# Altium project diplomka_hiearchical.PrjPcb (part 4 of 4)
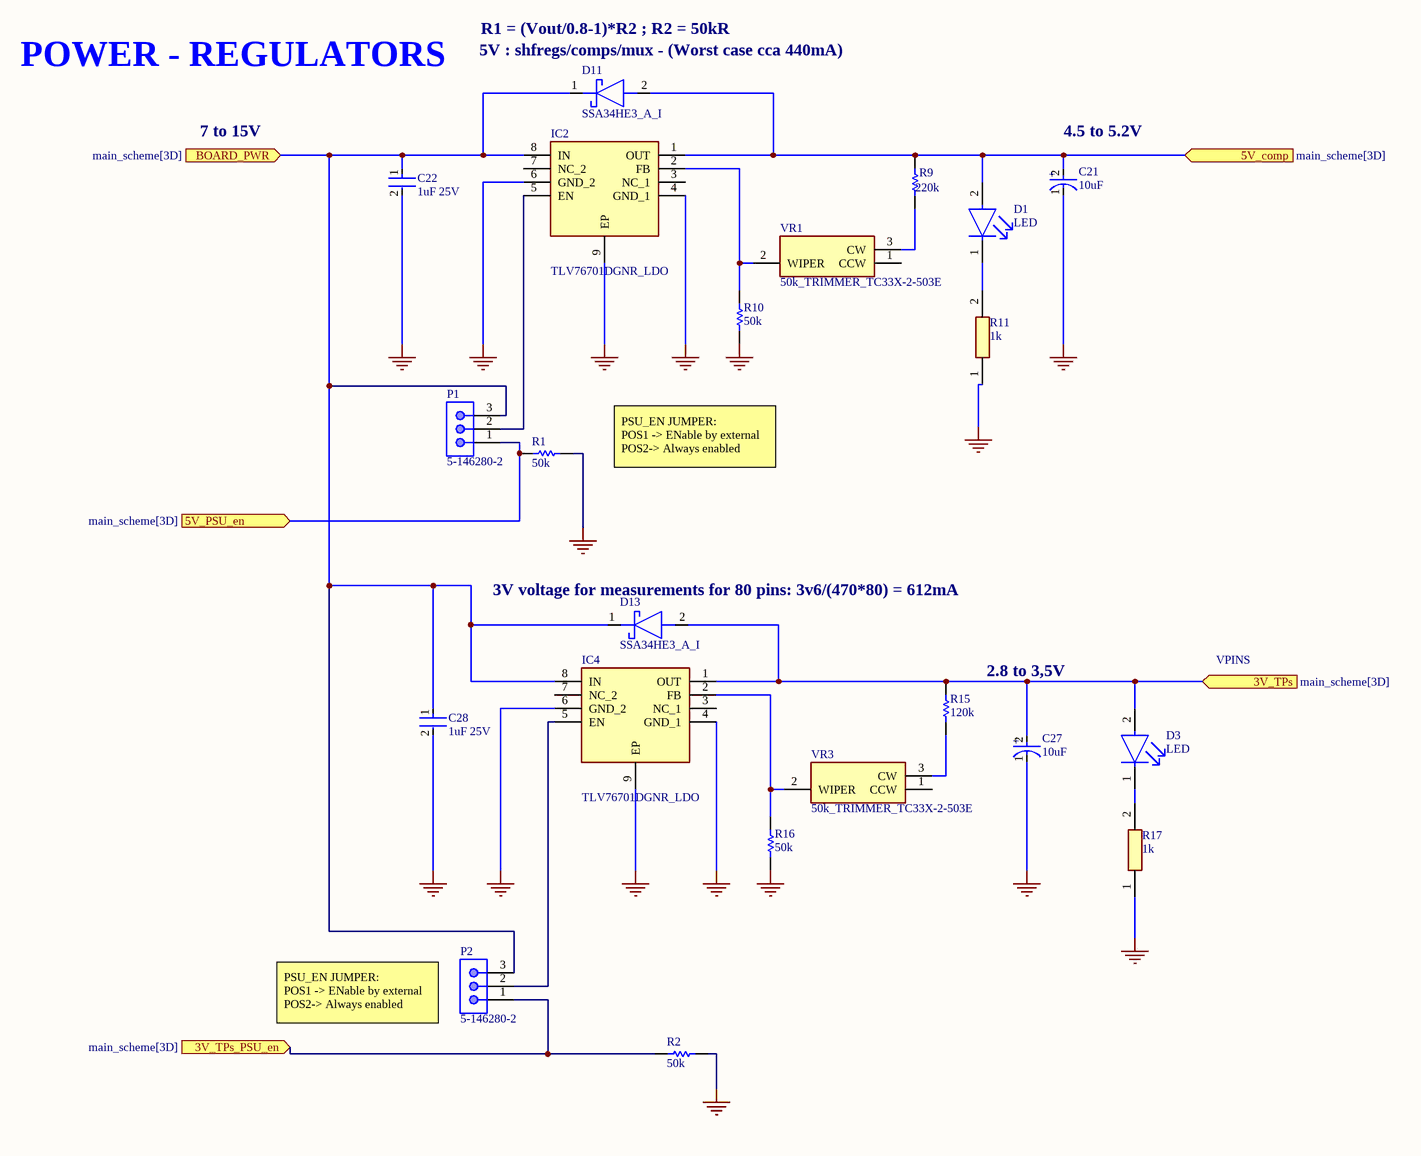
[diagram p6: POWER.SchDoc]

## Nets that join several sheets (continued)
Net8pins10_U3_5: U_ALL_channels/8pins10 (8pins10_U3.5), U_ALL_channels/8pins10/dTP (U_ALL_channels_8pins10_dTP_IC1#2.7 U_ALL_channels_8pins10_dTP_R6#2.2)
Net8pins10_U3_12: U_ALL_channels/8pins10 (8pins10_U3.12), U_ALL_channels/8pins10/dTP (U_ALL_channels_8pins10_dTP_IC1#3.7 U_ALL_channels_8pins10_dTP_R6#3.2)
Net8pins10_U3_13: U_ALL_channels/8pins10 (8pins10_U3.13), U_ALL_channels/8pins10/dTP (U_ALL_channels_8pins10_dTP_IC1#4.1 U_ALL_channels_8pins10_dTP_R5#4.2)
Net8pins10_U3_14: U_ALL_channels/8pins10 (8pins10_U3.14), U_ALL_channels/8pins10/dTP (U_ALL_channels_8pins10_dTP_IC1#4.7 U_ALL_channels_8pins10_dTP_R6#4.2)
Net8pins10_U3_15: U_ALL_channels/8pins10 (8pins10_U3.15), U_ALL_channels/8pins10/dTP (U_ALL_channels_8pins10_dTP_IC1#3.1 U_ALL_channels_8pins10_dTP_R5#3.2)
Net8pins10_U4_1: U_ALL_channels/8pins10 (8pins10_U4.1), U_ALL_channels/8pins10/dTP (U_ALL_channels_8pins10_dTP_Q1#4.1)
Net8pins10_U4_2: U_ALL_channels/8pins10 (8pins10_U4.2), U_ALL_channels/8pins10/dTP (U_ALL_channels_8pins10_dTP_Q2#3.1)
Net8pins10_U4_3: U_ALL_channels/8pins10 (8pins10_U4.3), U_ALL_channels/8pins10/dTP (U_ALL_channels_8pins10_dTP_Q1#3.1)
Net8pins10_U4_4: U_ALL_channels/8pins10 (8pins10_U4.4), U_ALL_channels/8pins10/dTP (U_ALL_channels_8pins10_dTP_Q2#2.1)
Net8pins10_U4_5: U_ALL_channels/8pins10 (8pins10_U4.5), U_ALL_channels/8pins10/dTP (U_ALL_channels_8pins10_dTP_Q1#2.1)
Net8pins10_U4_6: U_ALL_channels/8pins10 (8pins10_U4.6), U_ALL_channels/8pins10/dTP (U_ALL_channels_8pins10_dTP_Q2#1.1)
Net8pins10_U4_7: U_ALL_channels/8pins10 (8pins10_U4.7), U_ALL_channels/8pins10/dTP (U_ALL_channels_8pins10_dTP_Q1#1.1)
Net8pins10_U4_15: U_ALL_channels/8pins10 (8pins10_U4.15), U_ALL_channels/8pins10/dTP (U_ALL_channels_8pins10_dTP_Q2#4.1)
NMOS_SHFT_1TO5_NOE: main_scheme (J22.41), U_ALL_channels/8pins1 (8pins1_U2.13), U_ALL_channels/8pins2 (8pins2_U2.13), U_ALL_channels/8pins3 (8pins3_U2.13), U_ALL_channels/8pins4 (8pins4_U2.13), U_ALL_channels/8pins5 (8pins5_U2.13)
NMOS_SHFT_1TO5_RCLK: main_scheme (J22.45), U_ALL_channels/8pins1 (8pins1_U2.12), U_ALL_channels/8pins2 (8pins2_U2.12), U_ALL_channels/8pins3 (8pins3_U2.12), U_ALL_channels/8pins4 (8pins4_U2.12), U_ALL_channels/8pins5 (8pins5_U2.12)
NMOS_SHFT_1TO5_SER: main_scheme (J22.43), U_ALL_channels/8pins1 (8pins1_U2.14)
NMOS_SHFT_1TO5_SRCLK: main_scheme (J22.47), U_ALL_channels/8pins1 (8pins1_U2.11), U_ALL_channels/8pins2 (8pins2_U2.11), U_ALL_channels/8pins3 (8pins3_U2.11), U_ALL_channels/8pins4 (8pins4_U2.11), U_ALL_channels/8pins5 (8pins5_U2.11)
NMOS_SHFT_1TO5_SRCLR: main_scheme (J22.49), U_ALL_channels/8pins1 (8pins1_U2.10), U_ALL_channels/8pins2 (8pins2_U2.10), U_ALL_channels/8pins3 (8pins3_U2.10), U_ALL_channels/8pins4 (8pins4_U2.10), U_ALL_channels/8pins5 (8pins5_U2.10)
NMOS_SHFT_6TO10_NOE: main_scheme (J22.5), U_ALL_channels/8pins6 (8pins6_U2.13), U_ALL_channels/8pins7 (8pins7_U2.13), U_ALL_channels/8pins8 (8pins8_U2.13), U_ALL_channels/8pins9 (8pins9_U2.13), U_ALL_channels/8pins10 (8pins10_U2.13)
NMOS_SHFT_6TO10_RCLK: main_scheme (J22.7), U_ALL_channels/8pins6 (8pins6_U2.12), U_ALL_channels/8pins7 (8pins7_U2.12), U_ALL_channels/8pins8 (8pins8_U2.12), U_ALL_channels/8pins9 (8pins9_U2.12), U_ALL_channels/8pins10 (8pins10_U2.12)
NMOS_SHFT_6TO10_SER: main_scheme (J22.3), U_ALL_channels/8pins6 (8pins6_U2.14)
NMOS_SHFT_6TO10_SRCLK: main_scheme (J22.9), U_ALL_channels/8pins6 (8pins6_U2.11), U_ALL_channels/8pins7 (8pins7_U2.11), U_ALL_channels/8pins8 (8pins8_U2.11), U_ALL_channels/8pins9 (8pins9_U2.11), U_ALL_channels/8pins10 (8pins10_U2.11)
NMOS_SHFT_6TO10_SRCLR: main_scheme (J22.11), U_ALL_channels/8pins6 (8pins6_U2.10), U_ALL_channels/8pins7 (8pins7_U2.10), U_ALL_channels/8pins8 (8pins8_U2.10), U_ALL_channels/8pins9 (8pins9_U2.10), U_ALL_channels/8pins10 (8pins10_U2.10)
PMOS_SHFT_1TO5_NOE: main_scheme (J22.48), U_ALL_channels/8pins1 (8pins1_U4.13), U_ALL_channels/8pins2 (8pins2_U4.13), U_ALL_channels/8pins3 (8pins3_U4.13), U_ALL_channels/8pins4 (8pins4_U4.13), U_ALL_channels/8pins5 (8pins5_U4.13)
PMOS_SHFT_1TO5_RCLK: main_scheme (J22.46), U_ALL_channels/8pins1 (8pins1_U4.12), U_ALL_channels/8pins2 (8pins2_U4.12), U_ALL_channels/8pins3 (8pins3_U4.12), U_ALL_channels/8pins4 (8pins4_U4.12), U_ALL_channels/8pins5 (8pins5_U4.12)
PMOS_SHFT_1TO5_SER: main_scheme (J22.50), U_ALL_channels/8pins1 (8pins1_U4.14)
PMOS_SHFT_1TO5_SRCLK: main_scheme (J22.44), U_ALL_channels/8pins1 (8pins1_U4.11), U_ALL_channels/8pins2 (8pins2_U4.11), U_ALL_channels/8pins3 (8pins3_U4.11), U_ALL_channels/8pins4 (8pins4_U4.11), U_ALL_channels/8pins5 (8pins5_U4.11)
PMOS_SHFT_1TO5_SRCLR: main_scheme (J22.42), U_ALL_channels/8pins1 (8pins1_U4.10), U_ALL_channels/8pins2 (8pins2_U4.10), U_ALL_channels/8pins3 (8pins3_U4.10), U_ALL_channels/8pins4 (8pins4_U4.10), U_ALL_channels/8pins5 (8pins5_U4.10)
PMOS_SHFT_6TO10_NOE: main_scheme (J22.15), U_ALL_channels/8pins6 (8pins6_U4.13), U_ALL_channels/8pins7 (8pins7_U4.13), U_ALL_channels/8pins8 (8pins8_U4.13), U_ALL_channels/8pins9 (8pins9_U4.13), U_ALL_channels/8pins10 (8pins10_U4.13)
PMOS_SHFT_6TO10_RCLK: main_scheme (J22.17), U_ALL_channels/8pins6 (8pins6_U4.12), U_ALL_channels/8pins7 (8pins7_U4.12), U_ALL_channels/8pins8 (8pins8_U4.12), U_ALL_channels/8pins9 (8pins9_U4.12), U_ALL_channels/8pins10 (8pins10_U4.12)
PMOS_SHFT_6TO10_SER: main_scheme (J22.13), U_ALL_channels/8pins6 (8pins6_U4.14)
PMOS_SHFT_6TO10_SRCLK: main_scheme (J22.19), U_ALL_channels/8pins6 (8pins6_U4.11), U_ALL_channels/8pins7 (8pins7_U4.11), U_ALL_channels/8pins8 (8pins8_U4.11), U_ALL_channels/8pins9 (8pins9_U4.11), U_ALL_channels/8pins10 (8pins10_U4.11)
PMOS_SHFT_6TO10_SRCLR: main_scheme (J22.21), U_ALL_channels/8pins6 (8pins6_U4.10), U_ALL_channels/8pins7 (8pins7_U4.10), U_ALL_channels/8pins8 (8pins8_U4.10), U_ALL_channels/8pins9 (8pins9_U4.10), U_ALL_channels/8pins10 (8pins10_U4.10)
TP_1: main_scheme (J1.A1), U_ALL_channels/8pins1/dTP (U_ALL_channels_8pins1_dTP_IC1#4.3 U_ALL_channels_8pins1_dTP_Q2#4.3 U_ALL_channels_8pins1_dTP_R7#4.1)
TP_2: main_scheme (J1.B1), U_ALL_channels/8pins1/dTP (U_ALL_channels_8pins1_dTP_IC1#4.5 U_ALL_channels_8pins1_dTP_Q1#4.3 U_ALL_channels_8pins1_dTP_R8#4.1)
TP_3: main_scheme (J1.C1), U_ALL_channels/8pins1/dTP (U_ALL_channels_8pins1_dTP_IC1#3.3 U_ALL_channels_8pins1_dTP_Q2#3.3 U_ALL_channels_8pins1_dTP_R7#3.1)
TP_4: main_scheme (J1.A2), U_ALL_channels/8pins1/dTP (U_ALL_channels_8pins1_dTP_IC1#3.5 U_ALL_channels_8pins1_dTP_Q1#3.3 U_ALL_channels_8pins1_dTP_R8#3.1)
TP_5: main_scheme (J1.B2), U_ALL_channels/8pins1/dTP (U_ALL_channels_8pins1_dTP_IC1#2.3 U_ALL_channels_8pins1_dTP_Q2#2.3 U_ALL_channels_8pins1_dTP_R7#2.1)
TP_6: main_scheme (J1.C2), U_ALL_channels/8pins1/dTP (U_ALL_channels_8pins1_dTP_IC1#2.5 U_ALL_channels_8pins1_dTP_Q1#2.3 U_ALL_channels_8pins1_dTP_R8#2.1)
TP_7: main_scheme (J1.A3), U_ALL_channels/8pins1/dTP (U_ALL_channels_8pins1_dTP_IC1#1.3 U_ALL_channels_8pins1_dTP_Q2#1.3 U_ALL_channels_8pins1_dTP_R7#1.1)
TP_8: main_scheme (J1.B3), U_ALL_channels/8pins1/dTP (U_ALL_channels_8pins1_dTP_IC1#1.5 U_ALL_channels_8pins1_dTP_Q1#1.3 U_ALL_channels_8pins1_dTP_R8#1.1)
TP_9: main_scheme (J1.C3), U_ALL_channels/8pins2/dTP (U_ALL_channels_8pins2_dTP_IC1#4.3 U_ALL_channels_8pins2_dTP_Q2#4.3 U_ALL_channels_8pins2_dTP_R7#4.1)
TP_10: main_scheme (J1.A4), U_ALL_channels/8pins2/dTP (U_ALL_channels_8pins2_dTP_IC1#4.5 U_ALL_channels_8pins2_dTP_Q1#4.3 U_ALL_channels_8pins2_dTP_R8#4.1)
TP_11: main_scheme (J1.B4), U_ALL_channels/8pins2/dTP (U_ALL_channels_8pins2_dTP_IC1#3.3 U_ALL_channels_8pins2_dTP_Q2#3.3 U_ALL_channels_8pins2_dTP_R7#3.1)
TP_12: main_scheme (J1.C4), U_ALL_channels/8pins2/dTP (U_ALL_channels_8pins2_dTP_IC1#3.5 U_ALL_channels_8pins2_dTP_Q1#3.3 U_ALL_channels_8pins2_dTP_R8#3.1)
TP_13: main_scheme (J1.A5), U_ALL_channels/8pins2/dTP (U_ALL_channels_8pins2_dTP_IC1#2.3 U_ALL_channels_8pins2_dTP_Q2#2.3 U_ALL_channels_8pins2_dTP_R7#2.1)
TP_14: main_scheme (J1.B5), U_ALL_channels/8pins2/dTP (U_ALL_channels_8pins2_dTP_IC1#2.5 U_ALL_channels_8pins2_dTP_Q1#2.3 U_ALL_channels_8pins2_dTP_R8#2.1)
TP_15: main_scheme (J1.C5), U_ALL_channels/8pins2/dTP (U_ALL_channels_8pins2_dTP_IC1#1.3 U_ALL_channels_8pins2_dTP_Q2#1.3 U_ALL_channels_8pins2_dTP_R7#1.1)
TP_16: main_scheme (J1.A6), U_ALL_channels/8pins2/dTP (U_ALL_channels_8pins2_dTP_IC1#1.5 U_ALL_channels_8pins2_dTP_Q1#1.3 U_ALL_channels_8pins2_dTP_R8#1.1)
TP_17: main_scheme (J1.B6), U_ALL_channels/8pins3/dTP (U_ALL_channels_8pins3_dTP_IC1#4.3 U_ALL_channels_8pins3_dTP_Q2#4.3 U_ALL_channels_8pins3_dTP_R7#4.1)
TP_18: main_scheme (J1.C6), U_ALL_channels/8pins3/dTP (U_ALL_channels_8pins3_dTP_IC1#4.5 U_ALL_channels_8pins3_dTP_Q1#4.3 U_ALL_channels_8pins3_dTP_R8#4.1)
TP_19: main_scheme (J1.A7), U_ALL_channels/8pins3/dTP (U_ALL_channels_8pins3_dTP_IC1#3.3 U_ALL_channels_8pins3_dTP_Q2#3.3 U_ALL_channels_8pins3_dTP_R7#3.1)
TP_20: main_scheme (J1.B7), U_ALL_channels/8pins3/dTP (U_ALL_channels_8pins3_dTP_IC1#3.5 U_ALL_channels_8pins3_dTP_Q1#3.3 U_ALL_channels_8pins3_dTP_R8#3.1)
TP_21: main_scheme (J1.C7), U_ALL_channels/8pins3/dTP (U_ALL_channels_8pins3_dTP_IC1#2.3 U_ALL_channels_8pins3_dTP_Q2#2.3 U_ALL_channels_8pins3_dTP_R7#2.1)
TP_22: main_scheme (J1.A8), U_ALL_channels/8pins3/dTP (U_ALL_channels_8pins3_dTP_IC1#2.5 U_ALL_channels_8pins3_dTP_Q1#2.3 U_ALL_channels_8pins3_dTP_R8#2.1)
TP_23: main_scheme (J1.B8), U_ALL_channels/8pins3/dTP (U_ALL_channels_8pins3_dTP_IC1#1.3 U_ALL_channels_8pins3_dTP_Q2#1.3 U_ALL_channels_8pins3_dTP_R7#1.1)
TP_24: main_scheme (J1.C8), U_ALL_channels/8pins3/dTP (U_ALL_channels_8pins3_dTP_IC1#1.5 U_ALL_channels_8pins3_dTP_Q1#1.3 U_ALL_channels_8pins3_dTP_R8#1.1)
TP_25: main_scheme (J1.A9), U_ALL_channels/8pins4/dTP (U_ALL_channels_8pins4_dTP_IC1#4.3 U_ALL_channels_8pins4_dTP_Q2#4.3 U_ALL_channels_8pins4_dTP_R7#4.1)
TP_26: main_scheme (J1.B9), U_ALL_channels/8pins4/dTP (U_ALL_channels_8pins4_dTP_IC1#4.5 U_ALL_channels_8pins4_dTP_Q1#4.3 U_ALL_channels_8pins4_dTP_R8#4.1)
TP_27: main_scheme (J1.C9), U_ALL_channels/8pins4/dTP (U_ALL_channels_8pins4_dTP_IC1#3.3 U_ALL_channels_8pins4_dTP_Q2#3.3 U_ALL_channels_8pins4_dTP_R7#3.1)
TP_28: main_scheme (J1.A10), U_ALL_channels/8pins4/dTP (U_ALL_channels_8pins4_dTP_IC1#3.5 U_ALL_channels_8pins4_dTP_Q1#3.3 U_ALL_channels_8pins4_dTP_R8#3.1)
TP_29: main_scheme (J1.B10), U_ALL_channels/8pins4/dTP (U_ALL_channels_8pins4_dTP_IC1#2.3 U_ALL_channels_8pins4_dTP_Q2#2.3 U_ALL_channels_8pins4_dTP_R7#2.1)
TP_30: main_scheme (J1.C10), U_ALL_channels/8pins4/dTP (U_ALL_channels_8pins4_dTP_IC1#2.5 U_ALL_channels_8pins4_dTP_Q1#2.3 U_ALL_channels_8pins4_dTP_R8#2.1)
TP_31: main_scheme (J1.A11), U_ALL_channels/8pins4/dTP (U_ALL_channels_8pins4_dTP_IC1#1.3 U_ALL_channels_8pins4_dTP_Q2#1.3 U_ALL_channels_8pins4_dTP_R7#1.1)
TP_32: main_scheme (J1.B11), U_ALL_channels/8pins4/dTP (U_ALL_channels_8pins4_dTP_IC1#1.5 U_ALL_channels_8pins4_dTP_Q1#1.3 U_ALL_channels_8pins4_dTP_R8#1.1)
TP_33: main_scheme (J1.C11), U_ALL_channels/8pins5/dTP (U_ALL_channels_8pins5_dTP_IC1#4.3 U_ALL_channels_8pins5_dTP_Q2#4.3 U_ALL_channels_8pins5_dTP_R7#4.1)
TP_34: main_scheme (J1.A12), U_ALL_channels/8pins5/dTP (U_ALL_channels_8pins5_dTP_IC1#4.5 U_ALL_channels_8pins5_dTP_Q1#4.3 U_ALL_channels_8pins5_dTP_R8#4.1)
TP_35: main_scheme (J1.B12), U_ALL_channels/8pins5/dTP (U_ALL_channels_8pins5_dTP_IC1#3.3 U_ALL_channels_8pins5_dTP_Q2#3.3 U_ALL_channels_8pins5_dTP_R7#3.1)
TP_36: main_scheme (J1.C12), U_ALL_channels/8pins5/dTP (U_ALL_channels_8pins5_dTP_IC1#3.5 U_ALL_channels_8pins5_dTP_Q1#3.3 U_ALL_channels_8pins5_dTP_R8#3.1)
TP_37: main_scheme (J1.A13), U_ALL_channels/8pins5/dTP (U_ALL_channels_8pins5_dTP_IC1#2.3 U_ALL_channels_8pins5_dTP_Q2#2.3 U_ALL_channels_8pins5_dTP_R7#2.1)
TP_38: main_scheme (J1.B13), U_ALL_channels/8pins5/dTP (U_ALL_channels_8pins5_dTP_IC1#2.5 U_ALL_channels_8pins5_dTP_Q1#2.3 U_ALL_channels_8pins5_dTP_R8#2.1)
TP_39: main_scheme (J1.C13), U_ALL_channels/8pins5/dTP (U_ALL_channels_8pins5_dTP_IC1#1.3 U_ALL_channels_8pins5_dTP_Q2#1.3 U_ALL_channels_8pins5_dTP_R7#1.1)
TP_40: main_scheme (J1.A14), U_ALL_channels/8pins5/dTP (U_ALL_channels_8pins5_dTP_IC1#1.5 U_ALL_channels_8pins5_dTP_Q1#1.3 U_ALL_channels_8pins5_dTP_R8#1.1)
TP_41: main_scheme (J1.B14), U_ALL_channels/8pins6/dTP (U_ALL_channels_8pins6_dTP_IC1#4.3 U_ALL_channels_8pins6_dTP_Q2#4.3 U_ALL_channels_8pins6_dTP_R7#4.1)
TP_42: main_scheme (J1.C14), U_ALL_channels/8pins6/dTP (U_ALL_channels_8pins6_dTP_IC1#4.5 U_ALL_channels_8pins6_dTP_Q1#4.3 U_ALL_channels_8pins6_dTP_R8#4.1)
TP_43: main_scheme (J1.A15), U_ALL_channels/8pins6/dTP (U_ALL_channels_8pins6_dTP_IC1#3.3 U_ALL_channels_8pins6_dTP_Q2#3.3 U_ALL_channels_8pins6_dTP_R7#3.1)
TP_44: main_scheme (J1.B15), U_ALL_channels/8pins6/dTP (U_ALL_channels_8pins6_dTP_IC1#3.5 U_ALL_channels_8pins6_dTP_Q1#3.3 U_ALL_channels_8pins6_dTP_R8#3.1)
TP_45: main_scheme (J1.C15), U_ALL_channels/8pins6/dTP (U_ALL_channels_8pins6_dTP_IC1#2.3 U_ALL_channels_8pins6_dTP_Q2#2.3 U_ALL_channels_8pins6_dTP_R7#2.1)
TP_46: main_scheme (J1.A16), U_ALL_channels/8pins6/dTP (U_ALL_channels_8pins6_dTP_IC1#2.5 U_ALL_channels_8pins6_dTP_Q1#2.3 U_ALL_channels_8pins6_dTP_R8#2.1)
TP_47: main_scheme (J1.B16), U_ALL_channels/8pins6/dTP (U_ALL_channels_8pins6_dTP_IC1#1.3 U_ALL_channels_8pins6_dTP_Q2#1.3 U_ALL_channels_8pins6_dTP_R7#1.1)
TP_48: main_scheme (J1.C16), U_ALL_channels/8pins6/dTP (U_ALL_channels_8pins6_dTP_IC1#1.5 U_ALL_channels_8pins6_dTP_Q1#1.3 U_ALL_channels_8pins6_dTP_R8#1.1)
TP_49: main_scheme (J1.A17), U_ALL_channels/8pins7/dTP (U_ALL_channels_8pins7_dTP_IC1#4.3 U_ALL_channels_8pins7_dTP_Q2#4.3 U_ALL_channels_8pins7_dTP_R7#4.1)
TP_50: main_scheme (J1.B17), U_ALL_channels/8pins7/dTP (U_ALL_channels_8pins7_dTP_IC1#4.5 U_ALL_channels_8pins7_dTP_Q1#4.3 U_ALL_channels_8pins7_dTP_R8#4.1)
TP_51: main_scheme (J1.C17), U_ALL_channels/8pins7/dTP (U_ALL_channels_8pins7_dTP_IC1#3.3 U_ALL_channels_8pins7_dTP_Q2#3.3 U_ALL_channels_8pins7_dTP_R7#3.1)
TP_52: main_scheme (J1.A18), U_ALL_channels/8pins7/dTP (U_ALL_channels_8pins7_dTP_IC1#3.5 U_ALL_channels_8pins7_dTP_Q1#3.3 U_ALL_channels_8pins7_dTP_R8#3.1)
TP_53: main_scheme (J1.B18), U_ALL_channels/8pins7/dTP (U_ALL_channels_8pins7_dTP_IC1#2.3 U_ALL_channels_8pins7_dTP_Q2#2.3 U_ALL_channels_8pins7_dTP_R7#2.1)
TP_54: main_scheme (J1.C18), U_ALL_channels/8pins7/dTP (U_ALL_channels_8pins7_dTP_IC1#2.5 U_ALL_channels_8pins7_dTP_Q1#2.3 U_ALL_channels_8pins7_dTP_R8#2.1)
TP_55: main_scheme (J1.A19), U_ALL_channels/8pins7/dTP (U_ALL_channels_8pins7_dTP_IC1#1.3 U_ALL_channels_8pins7_dTP_Q2#1.3 U_ALL_channels_8pins7_dTP_R7#1.1)
TP_56: main_scheme (J1.B19), U_ALL_channels/8pins7/dTP (U_ALL_channels_8pins7_dTP_IC1#1.5 U_ALL_channels_8pins7_dTP_Q1#1.3 U_ALL_channels_8pins7_dTP_R8#1.1)
TP_57: main_scheme (J1.C19), U_ALL_channels/8pins8/dTP (U_ALL_channels_8pins8_dTP_IC1#4.3 U_ALL_channels_8pins8_dTP_Q2#4.3 U_ALL_channels_8pins8_dTP_R7#4.1)
TP_58: main_scheme (J1.A20), U_ALL_channels/8pins8/dTP (U_ALL_channels_8pins8_dTP_IC1#4.5 U_ALL_channels_8pins8_dTP_Q1#4.3 U_ALL_channels_8pins8_dTP_R8#4.1)
TP_59: main_scheme (J1.B20), U_ALL_channels/8pins8/dTP (U_ALL_channels_8pins8_dTP_IC1#3.3 U_ALL_channels_8pins8_dTP_Q2#3.3 U_ALL_channels_8pins8_dTP_R7#3.1)
TP_60: main_scheme (J1.C20), U_ALL_channels/8pins8/dTP (U_ALL_channels_8pins8_dTP_IC1#3.5 U_ALL_channels_8pins8_dTP_Q1#3.3 U_ALL_channels_8pins8_dTP_R8#3.1)
TP_61: main_scheme (J1.A21), U_ALL_channels/8pins8/dTP (U_ALL_channels_8pins8_dTP_IC1#2.3 U_ALL_channels_8pins8_dTP_Q2#2.3 U_ALL_channels_8pins8_dTP_R7#2.1)
TP_62: main_scheme (J1.B21), U_ALL_channels/8pins8/dTP (U_ALL_channels_8pins8_dTP_IC1#2.5 U_ALL_channels_8pins8_dTP_Q1#2.3 U_ALL_channels_8pins8_dTP_R8#2.1)
TP_63: main_scheme (J1.C21), U_ALL_channels/8pins8/dTP (U_ALL_channels_8pins8_dTP_IC1#1.3 U_ALL_channels_8pins8_dTP_Q2#1.3 U_ALL_channels_8pins8_dTP_R7#1.1)
TP_64: main_scheme (J1.A22), U_ALL_channels/8pins8/dTP (U_ALL_channels_8pins8_dTP_IC1#1.5 U_ALL_channels_8pins8_dTP_Q1#1.3 U_ALL_channels_8pins8_dTP_R8#1.1)
TP_65: main_scheme (J1.B22), U_ALL_channels/8pins9/dTP (U_ALL_channels_8pins9_dTP_IC1#4.3 U_ALL_channels_8pins9_dTP_Q2#4.3 U_ALL_channels_8pins9_dTP_R7#4.1)
TP_66: main_scheme (J1.C22), U_ALL_channels/8pins9/dTP (U_ALL_channels_8pins9_dTP_IC1#4.5 U_ALL_channels_8pins9_dTP_Q1#4.3 U_ALL_channels_8pins9_dTP_R8#4.1)
TP_67: main_scheme (J1.A23), U_ALL_channels/8pins9/dTP (U_ALL_channels_8pins9_dTP_IC1#3.3 U_ALL_channels_8pins9_dTP_Q2#3.3 U_ALL_channels_8pins9_dTP_R7#3.1)
TP_68: main_scheme (J1.B23), U_ALL_channels/8pins9/dTP (U_ALL_channels_8pins9_dTP_IC1#3.5 U_ALL_channels_8pins9_dTP_Q1#3.3 U_ALL_channels_8pins9_dTP_R8#3.1)
TP_69: main_scheme (J1.C23), U_ALL_channels/8pins9/dTP (U_ALL_channels_8pins9_dTP_IC1#2.3 U_ALL_channels_8pins9_dTP_Q2#2.3 U_ALL_channels_8pins9_dTP_R7#2.1)
TP_70: main_scheme (J1.A24), U_ALL_channels/8pins9/dTP (U_ALL_channels_8pins9_dTP_IC1#2.5 U_ALL_channels_8pins9_dTP_Q1#2.3 U_ALL_channels_8pins9_dTP_R8#2.1)
TP_71: main_scheme (J1.B24), U_ALL_channels/8pins9/dTP (U_ALL_channels_8pins9_dTP_IC1#1.3 U_ALL_channels_8pins9_dTP_Q2#1.3 U_ALL_channels_8pins9_dTP_R7#1.1)
TP_72: main_scheme (J1.C24), U_ALL_channels/8pins9/dTP (U_ALL_channels_8pins9_dTP_IC1#1.5 U_ALL_channels_8pins9_dTP_Q1#1.3 U_ALL_channels_8pins9_dTP_R8#1.1)
TP_73: main_scheme (J1.A25), U_ALL_channels/8pins10/dTP (U_ALL_channels_8pins10_dTP_IC1#4.3 U_ALL_channels_8pins10_dTP_Q2#4.3 U_ALL_channels_8pins10_dTP_R7#4.1)
TP_74: main_scheme (J1.B25), U_ALL_channels/8pins10/dTP (U_ALL_channels_8pins10_dTP_IC1#4.5 U_ALL_channels_8pins10_dTP_Q1#4.3 U_ALL_channels_8pins10_dTP_R8#4.1)
TP_75: main_scheme (J1.C25), U_ALL_channels/8pins10/dTP (U_ALL_channels_8pins10_dTP_IC1#3.3 U_ALL_channels_8pins10_dTP_Q2#3.3 U_ALL_channels_8pins10_dTP_R7#3.1)
TP_76: main_scheme (J1.A26), U_ALL_channels/8pins10/dTP (U_ALL_channels_8pins10_dTP_IC1#3.5 U_ALL_channels_8pins10_dTP_Q1#3.3 U_ALL_channels_8pins10_dTP_R8#3.1)
TP_77: main_scheme (J1.B26), U_ALL_channels/8pins10/dTP (U_ALL_channels_8pins10_dTP_IC1#2.3 U_ALL_channels_8pins10_dTP_Q2#2.3 U_ALL_channels_8pins10_dTP_R7#2.1)
TP_78: main_scheme (J1.C26), U_ALL_channels/8pins10/dTP (U_ALL_channels_8pins10_dTP_IC1#2.5 U_ALL_channels_8pins10_dTP_Q1#2.3 U_ALL_channels_8pins10_dTP_R8#2.1)
TP_79: main_scheme (J1.A27), U_ALL_channels/8pins10/dTP (U_ALL_channels_8pins10_dTP_IC1#1.3 U_ALL_channels_8pins10_dTP_Q2#1.3 U_ALL_channels_8pins10_dTP_R7#1.1)
TP_80: main_scheme (J1.B27), U_ALL_channels/8pins10/dTP (U_ALL_channels_8pins10_dTP_IC1#1.5 U_ALL_channels_8pins10_dTP_Q1#1.3 U_ALL_channels_8pins10_dTP_R8#1.1)
Vcomp: U_ALL_channels/8pins1 (6 pins), U_ALL_channels/8pins1/dTP (U_ALL_channels_8pins1_dTP_IC1#1.8), U_ALL_channels/8pins1/dTP (U_ALL_channels_8pins1_dTP_IC1#2.8), U_ALL_channels/8pins1/dTP (U_ALL_channels_8pins1_dTP_IC1#3.8), U_ALL_channels/8pins1/dTP (U_ALL_channels_8pins1_dTP_IC1#4.8), U_ALL_channels/8pins2 (6 pins), U_ALL_channels/8pins2/dTP (U_ALL_channels_8pins2_dTP_IC1#1.8), U_ALL_channels/8pins2/dTP (U_ALL_channels_8pins2_dTP_IC1#2.8), U_ALL_channels/8pins2/dTP (U_ALL_channels_8pins2_dTP_IC1#3.8), U_ALL_channels/8pins2/dTP (U_ALL_channels_8pins2_dTP_IC1#4.8), U_ALL_channels/8pins3 (6 pins), U_ALL_channels/8pins3/dTP (U_ALL_channels_8pins3_dTP_IC1#1.8), U_ALL_channels/8pins3/dTP (U_ALL_channels_8pins3_dTP_IC1#2.8), U_ALL_channels/8pins3/dTP (U_ALL_channels_8pins3_dTP_IC1#3.8), U_ALL_channels/8pins3/dTP (U_ALL_channels_8pins3_dTP_IC1#4.8), U_ALL_channels/8pins4 (6 pins), U_ALL_channels/8pins4/dTP (U_ALL_channels_8pins4_dTP_IC1#1.8), U_ALL_channels/8pins4/dTP (U_ALL_channels_8pins4_dTP_IC1#2.8), U_ALL_channels/8pins4/dTP (U_ALL_channels_8pins4_dTP_IC1#3.8), U_ALL_channels/8pins4/dTP (U_ALL_channels_8pins4_dTP_IC1#4.8), U_ALL_channels/8pins5 (6 pins), U_ALL_channels/8pins5/dTP (U_ALL_channels_8pins5_dTP_IC1#1.8), U_ALL_channels/8pins5/dTP (U_ALL_channels_8pins5_dTP_IC1#2.8), U_ALL_channels/8pins5/dTP (U_ALL_channels_8pins5_dTP_IC1#3.8), U_ALL_channels/8pins5/dTP (U_ALL_channels_8pins5_dTP_IC1#4.8), U_ALL_channels/8pins6 (6 pins), U_ALL_channels/8pins6/dTP (U_ALL_channels_8pins6_dTP_IC1#1.8), U_ALL_channels/8pins6/dTP (U_ALL_channels_8pins6_dTP_IC1#2.8), U_ALL_channels/8pins6/dTP (U_ALL_channels_8pins6_dTP_IC1#3.8), U_ALL_channels/8pins6/dTP (U_ALL_channels_8pins6_dTP_IC1#4.8), U_ALL_channels/8pins7 (6 pins), U_ALL_channels/8pins7/dTP (U_ALL_channels_8pins7_dTP_IC1#1.8), U_ALL_channels/8pins7/dTP (U_ALL_channels_8pins7_dTP_IC1#2.8), U_ALL_channels/8pins7/dTP (U_ALL_channels_8pins7_dTP_IC1#3.8), U_ALL_channels/8pins7/dTP (U_ALL_channels_8pins7_dTP_IC1#4.8), U_ALL_channels/8pins8 (6 pins), U_ALL_channels/8pins8/dTP (U_ALL_channels_8pins8_dTP_IC1#1.8), U_ALL_channels/8pins8/dTP (U_ALL_channels_8pins8_dTP_IC1#2.8), U_ALL_channels/8pins8/dTP (U_ALL_channels_8pins8_dTP_IC1#3.8), U_ALL_channels/8pins8/dTP (U_ALL_channels_8pins8_dTP_IC1#4.8), U_ALL_channels/8pins9 (6 pins), U_ALL_channels/8pins9/dTP (U_ALL_channels_8pins9_dTP_IC1#1.8), U_ALL_channels/8pins9/dTP (U_ALL_channels_8pins9_dTP_IC1#2.8), U_ALL_channels/8pins9/dTP (U_ALL_channels_8pins9_dTP_IC1#3.8), U_ALL_channels/8pins9/dTP (U_ALL_channels_8pins9_dTP_IC1#4.8), U_ALL_channels/8pins10 (6 pins), U_ALL_channels/8pins10/dTP (U_ALL_channels_8pins10_dTP_IC1#1.8), U_ALL_channels/8pins10/dTP (U_ALL_channels_8pins10_dTP_IC1#2.8), U_ALL_channels/8pins10/dTP (U_ALL_channels_8pins10_dTP_IC1#3.8), U_ALL_channels/8pins10/dTP (U_ALL_channels_8pins10_dTP_IC1#4.8), POWER (5 pins)

## Assembly variants
No_Protection_fitted: all parts fitted